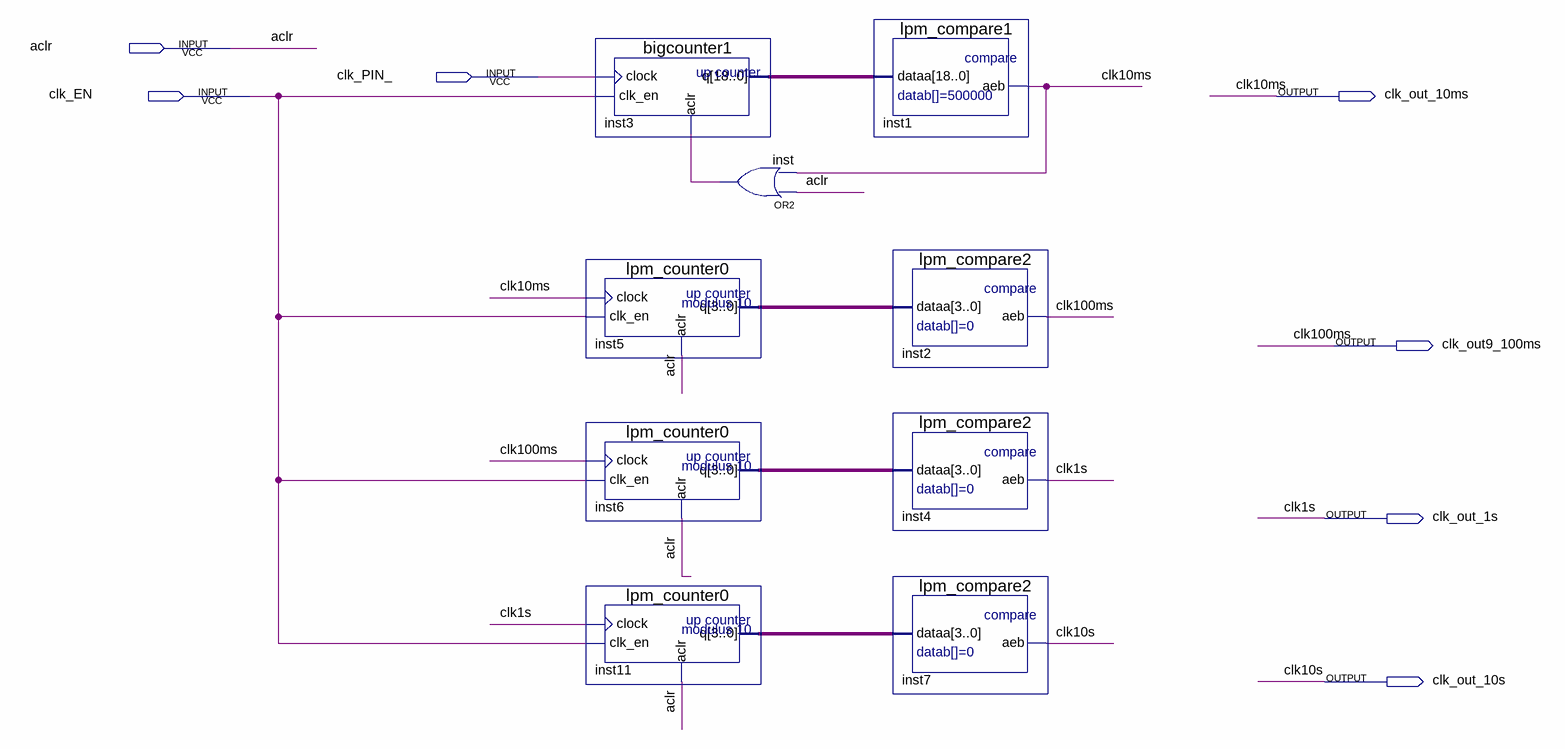
[diagram p0: schematic sheet]
// Quartus schematic tick_generator.bdf as structural Verilog: 9 symbols, 7 pins
module tick_generator (
  input  aclr,
  input  clk_PIN_,
  input  clk_EN,
  output clk_out_10ms,
  output clk_out9_100ms,
  output clk_out_1s,
  output clk_out_10s
);

  wire inst_out;
  wire [3:0] inst5_q, inst6_q, inst11_q;
  wire [18:0] inst3_q;

  bigcounter1 inst3 (.clock(clk_PIN_), .clk_en(clk_EN), .aclr(inst_out), .q(inst3_q));
  lpm_counter0 inst5 (.clock(clk_out_10ms), .clk_en(clk_EN), .aclr(aclr), .q(inst5_q));
  lpm_counter0 inst6 (.clock(clk_out9_100ms), .clk_en(clk_EN), .aclr(aclr), .q(inst6_q));
  lpm_counter0 inst11 (.clock(clk_out_1s), .clk_en(clk_EN), .aclr(aclr), .q(inst11_q));
  or inst (inst_out, aclr, clk_out_10ms);
  lpm_compare1 inst1 (.dataa(inst3_q), .aeb(clk_out_10ms));
  lpm_compare2 inst2 (.dataa(inst5_q), .aeb(clk_out9_100ms));
  lpm_compare2 inst4 (.dataa(inst6_q), .aeb(clk_out_1s));
  lpm_compare2 inst7 (.dataa(inst11_q), .aeb(clk_out_10s));

  // Other names for the same wires on the sheet: clk1s = clk_out_1s; clk10ms = clk_out_10ms; clk10s = clk_out_10s;
  //   clk100ms = clk_out9_100ms
endmodule
